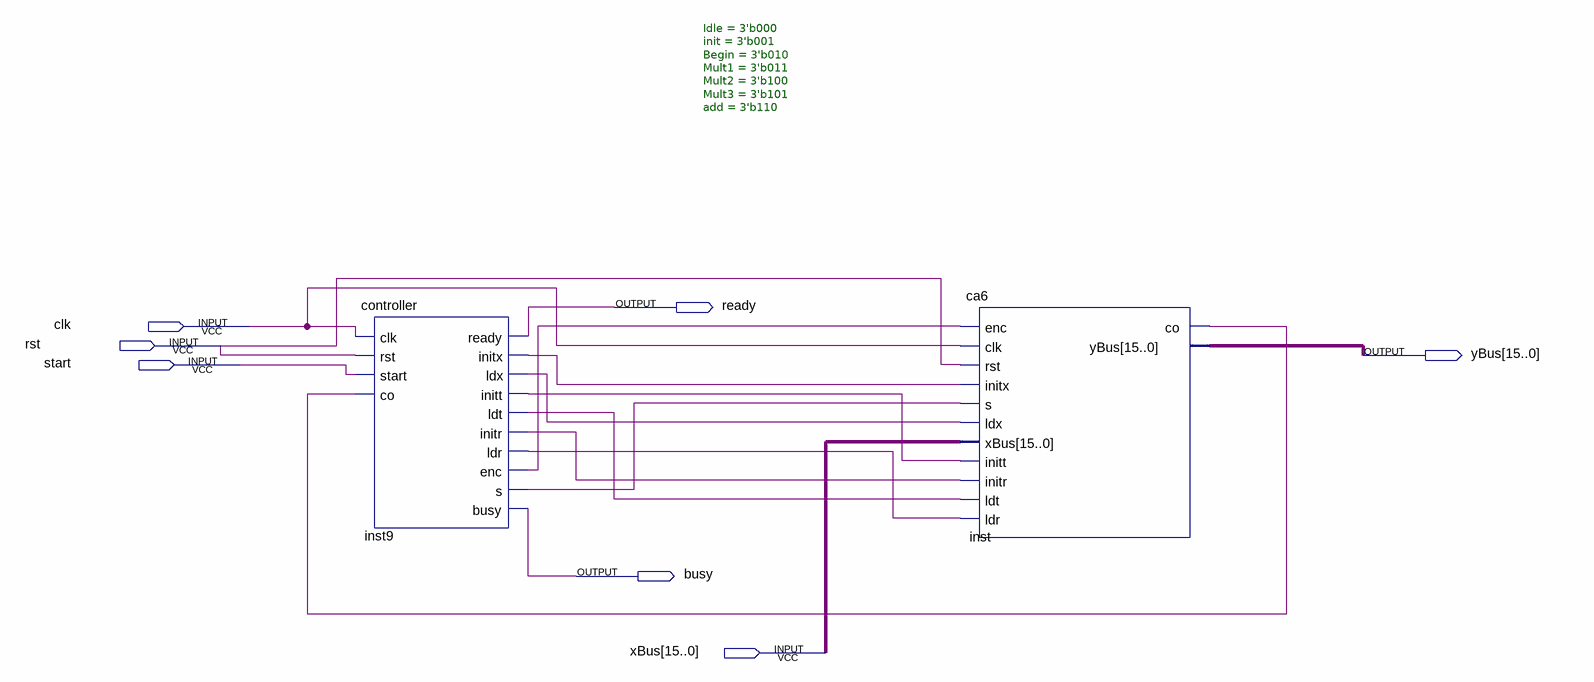
[diagram p0: schematic sheet]
// Quartus schematic ca6_final.bdf as structural Verilog: 2 symbols, 7 pins
module ca6_final (
  input  clk,
  input  rst,
  input  start,
  input  [15:0] xBus,
  output ready,
  output [15:0] yBus,
  output busy
);

  wire inst9_enc, inst9_initr, inst9_initt, inst9_initx, inst9_ldr, inst9_ldt, inst9_ldx, inst9_s, inst_co;

  controller #(.Idle(3'b000), .init(3'b001), .Begin(3'b010), .Mult1(3'b011), .Mult2(3'b100), .Mult3(3'b101), .add(3'b110)) inst9 (
    .clk(clk), .rst(rst), .start(start), .co(inst_co), .ready(ready), .initx(inst9_initx), .ldx(inst9_ldx),
    .initt(inst9_initt), .ldt(inst9_ldt), .initr(inst9_initr), .ldr(inst9_ldr), .enc(inst9_enc), .s(inst9_s),
    .busy(busy));
  ca6 inst (
    .enc(inst9_enc), .clk(clk), .rst(rst), .initx(inst9_initx), .s(inst9_s), .ldx(inst9_ldx), .xBus(xBus),
    .initt(inst9_initt), .initr(inst9_initr), .ldt(inst9_ldt), .ldr(inst9_ldr), .co(inst_co), .yBus(yBus));
endmodule
